# EAGLE design round board (EAGLE 7.2.0)
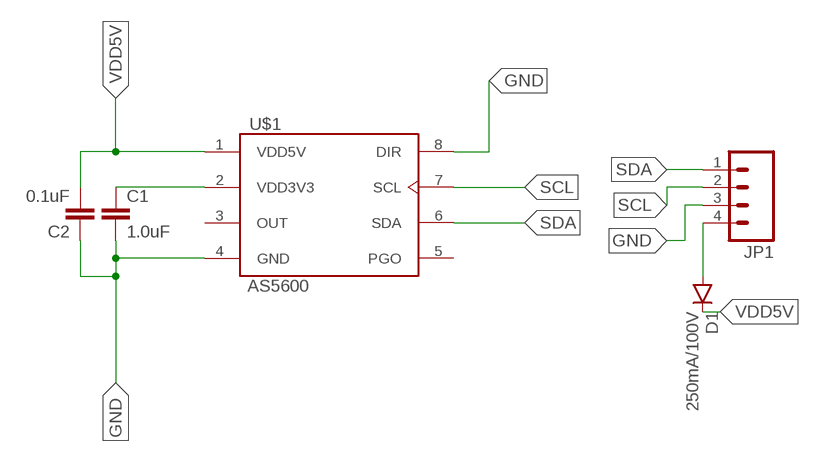
[diagram p0: schematic, sheet 1]

## Parts
C1  1.0uF  1.0UF-16V-10%(0603)  [0603-CAP]
C2  0.1uF  0.1UF-25V(+80/-20%)(0603)  [0603-CAP]
D1  250mA/100V  DIODEBAS16  [SOD-323]
JP1  M04LOCK  [1X04_LOCK]
U$1  AS5600  [SOIC8]

## Nets
GND: C1.2 C2.1 JP1.3 U$1.4(GND) U$1.8(DIR)
N$1: C1.1 U$1.2(VDD3V3)
N$2: D1.A JP1.4
SCL: JP1.2 U$1.7(SCL)
SDA: JP1.1 U$1.6(SDA)
VDD5V: C2.2 D1.C U$1.1(VDD5V)
Unconnected: U$1.3(OUT) U$1.5(PGO)

## Library data of the parts
C1 = SparkFun-Capacitors:1.0UF-16V-10%(0603): CAP-00868; PROD_ID: CAP-00868
C2 = SparkFun-Capacitors:0.1UF-25V(+80/-20%)(0603): CAP-00810 Ceramic Standard decoupling cap; PROD_ID: CAP-00810
D1 = SparkFun-DiscreteSemi:DIODE: Diode These are standard reverse protection diodes and small signal diodes. SMA package can handle up to about 1A. SOD-323 can handle about 200mA. What the SOD-323 package when ordering, there are some mfgs out there that are 5-pin packages.; PROD_ID: DIO-09646
JP1 = SparkFun-Connectors:M04: Header 4 Standard 4-pin 0.1" header. Use with straight break away headers (SKU : PRT-00116), right angle break away headers (PRT-00553), swiss pins (PRT-00743), machine pins (PRT-00117), and female headers (PRT-00115). Molex polarized connector foot print use with SKU : PRT-08231 with associated crimp pins and housings. 1MM SMD Version SKU: PRT-10208
U$1 = My Library:AS5600

## Board
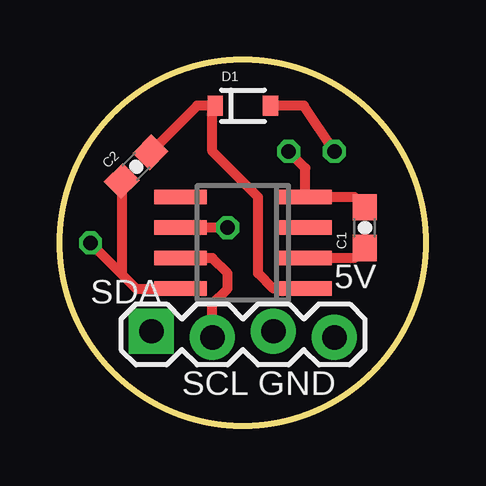
[diagram p1: board, top side]
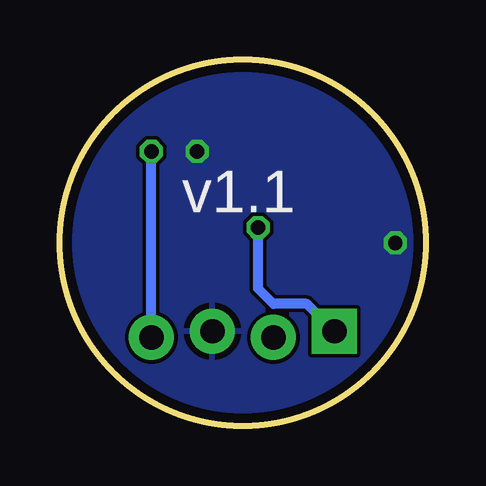
[diagram p2: board, bottom side, seen from below]

Size 15.24 x 15.24 mm. Coordinates in mm from the lower left corner, seen from the top.
Outline: circle at 7.62,7.62 radius 7.62
Copper layers (1*16): Top 0.0356mm / dielectric 1.5011mm / Bottom 0.0356mm
Design rules "LaenPCBOrder": minimum track width 6mil, minimum drill 13mil, track to track 6mil, track to pad 6mil, pad to pad 6mil, via to via 6mil, smd to smd 6mil, copper to edge 15mil, drill to drill 6mil, minimum pad ring 7mil, minimum via ring 7mil, stop-mask expansion 3mil, vias tented up to drill 0mil, thermal gap 10mil

### Footprints (pad centres in the part's own frame; a part is rotated, then mirrored left to right if it is on the bottom)
0603-CAP = smd 1.1 x 1: 1 -0.85,0; 2 0.85,0
SOD-323 = smd 0.63 x 0.83: A 1.15,0; C -1.15,0
1X04_LOCK = drill 1.016 pad 1.88 square: 1 0,0.127 | drill 1.016 pad 1.88: 2 2.54,-0.127; 3 5.08,0.127; 4 7.62,-0.127
SOIC8 = smd 0.6 x 2.2: 1 -1.905,-2.6; 2 -0.635,-2.6; 3 0.635,-2.6; 4 1.905,-2.6; 5 1.905,2.6; 6 0.635,2.6; 7 -0.635,2.6; 8 -1.905,2.6

### Placement (x,y rotation side)
C1  12.7,8.25 90 top
C2  3.18,10.8 45 top
D1  7.62,13.34 0 top
JP1  3.81,3.81 0 top
U$1  7.62,7.62 90 top

### Tracks (layer width: path | path; a pad name or v marks a point on that pad's centre or on a via)
GND  (via drill 0.6)
  Top 0.406: C1.2 12.28,9.52 U$1.4 10.22,10.73 v9.53,11.43 | C2.1 2.57,6.32 | 2.57,6.32 3.18,5.72 U$1.8 | 2.57,6.32 v1.27,7.62
  pour Bottom: 0,15.24 14.99,15.24 arc-90 15.24,14.99 15.24,0 0.25,0 arc-90 0,0.25
N$1
  Top 0.406: C1.1 12.28,6.99 U$1.2
N$2  (via drill 0.6)
  Top 0.406: v11.43,11.43 10.16,13.34 D1.A
  Bottom 0.406: JP1.4 v11.43,11.43
SCL
  Top 0.406: JP1.2 6.35,5.08 6.99,5.72 6.99,6.35 6.35,6.99 U$1.7
SDA  (via drill 0.6)
  Top 0.406: v6.99,8.25 U$1.6
  Bottom 0.406: JP1.1 4.95,5.08 6.35,5.08 6.99,5.72 v6.99,8.25
VDD5V
  Top 0.406: U$1.1 8.89,5.72 8.26,6.35 8.26,9.52 6.35,11.43 6.35,13.21 D1.C 5.72,13.34 C2.2

### Text on the board
tNames: SDA | 5V | SCL | GND
bNames: v1.1